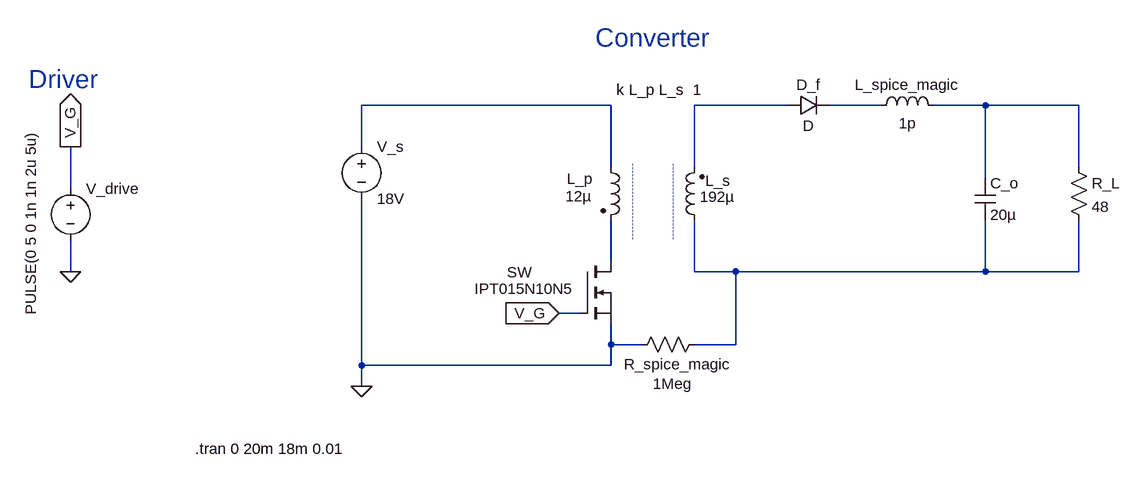
[diagram p0: schematic Flyback_v1.asc]
Flyback_v1.asc, the LTspice schematic file:
Version 4
SHEET 1 1172 800
WIRE 208 256 -176 256
WIRE 480 256 336 256
WIRE 624 256 544 256
WIRE 784 256 704 256
WIRE 928 256 784 256
WIRE -176 320 -176 256
WIRE 208 352 208 256
WIRE 336 352 336 256
WIRE 928 352 928 256
WIRE 784 368 784 256
WIRE -624 384 -624 320
WIRE 208 496 208 432
WIRE -624 512 -624 464
WIRE 336 512 336 432
WIRE 400 512 336 512
WIRE 784 512 784 432
WIRE 784 512 400 512
WIRE 928 512 928 432
WIRE 928 512 784 512
WIRE 160 576 128 576
WIRE 208 624 208 592
WIRE 256 624 208 624
WIRE 400 624 400 512
WIRE 400 624 336 624
WIRE -176 656 -176 400
WIRE 208 656 208 624
WIRE 208 656 -176 656
WIRE -176 688 -176 656
FLAG -176 688 0
FLAG 128 576 V_G
IOPIN 128 576 In
FLAG -624 512 0
FLAG -624 320 V_G
IOPIN -624 320 Out
SYMBOL voltage -176 304 R0
WINDOW 123 0 0 Left 0
WINDOW 39 0 0 Left 0
SYMATTR InstName V_s
SYMATTR Value 18V
SYMBOL res 912 336 R0
SYMATTR InstName R_L
SYMATTR Value 48
SYMBOL cap 768 368 R0
SYMATTR InstName C_o
SYMATTR Value 20µ
SYMBOL diode 480 272 R270
WINDOW 0 32 32 VTop 2
WINDOW 3 0 32 VBottom 2
SYMATTR InstName D_f
SYMBOL nmos 160 496 R0
WINDOW 0 -112 17 Left 2
WINDOW 3 -162 42 Left 2
SYMATTR InstName SW
SYMATTR Value IPT015N10N5
SYMBOL ind2 192 336 R0
WINDOW 0 -52 33 Left 2
WINDOW 3 -54 60 Left 2
SYMATTR InstName L_p
SYMATTR Value 12µ
SYMATTR Type ind
SYMATTR SpiceLine Rser=10m
SYMBOL ind2 352 448 R180
WINDOW 0 -40 76 Left 2
WINDOW 3 -47 51 Left 2
SYMATTR InstName L_s
SYMATTR Value 192µ
SYMATTR Type ind
SYMATTR SpiceLine Rser=50m
SYMBOL voltage -624 368 R0
WINDOW 3 -61 211 VLeft 2
WINDOW 123 0 0 Left 0
WINDOW 39 0 0 Left 0
SYMATTR Value PULSE(0 5 0 1n 1n 2u 5u)
SYMATTR InstName V_drive
SYMBOL res 352 608 R90
WINDOW 0 62 42 VBottom 2
WINDOW 3 61 49 VTop 2
SYMATTR InstName R_spice_magic
SYMATTR Value 1Meg
SYMBOL ind 608 272 R270
WINDOW 0 32 56 VTop 2
WINDOW 3 4 56 VBottom 2
SYMATTR InstName L_spice_magic
SYMATTR Value 1p
SYMATTR SpiceLine Rser=3m
TEXT 216 232 Left 2 !k L_p L_s  1
TEXT 240 464 VLeft 1 ;----------------------\n \n \n----------------------
TEXT 184 152 Left 4 ;Converter
TEXT -688 216 Left 4 ;Driver
TEXT -432 784 Left 2 !.tran 0 20m 18m 0.01

The netlist it stands for:
* Flyback_v1.asc
V_s N001 0 18V
R_L N004 N006 48
C_o N004 N006 20µ
D_f N002 N003 D
M§SW N005 V_G 0 0 IPT015N10N5
L_p N001 N005 12µ Rser=10m
L_s N006 N002 192µ Rser=50m
V_drive V_G 0 PULSE(0 5 0 1n 1n 2u 5u)
R_spice_magic N006 0 1Meg
L_spice_magic N003 N004 1p Rser=3m
.model D D
.lib standard.dio
.model NMOS NMOS
.model PMOS PMOS
.lib standard.mos
k L_p L_s  1
* ----------------------
* ----------------------
* Converter
* Driver
.tran 0 20m 18m 0.01
.backanno
.end